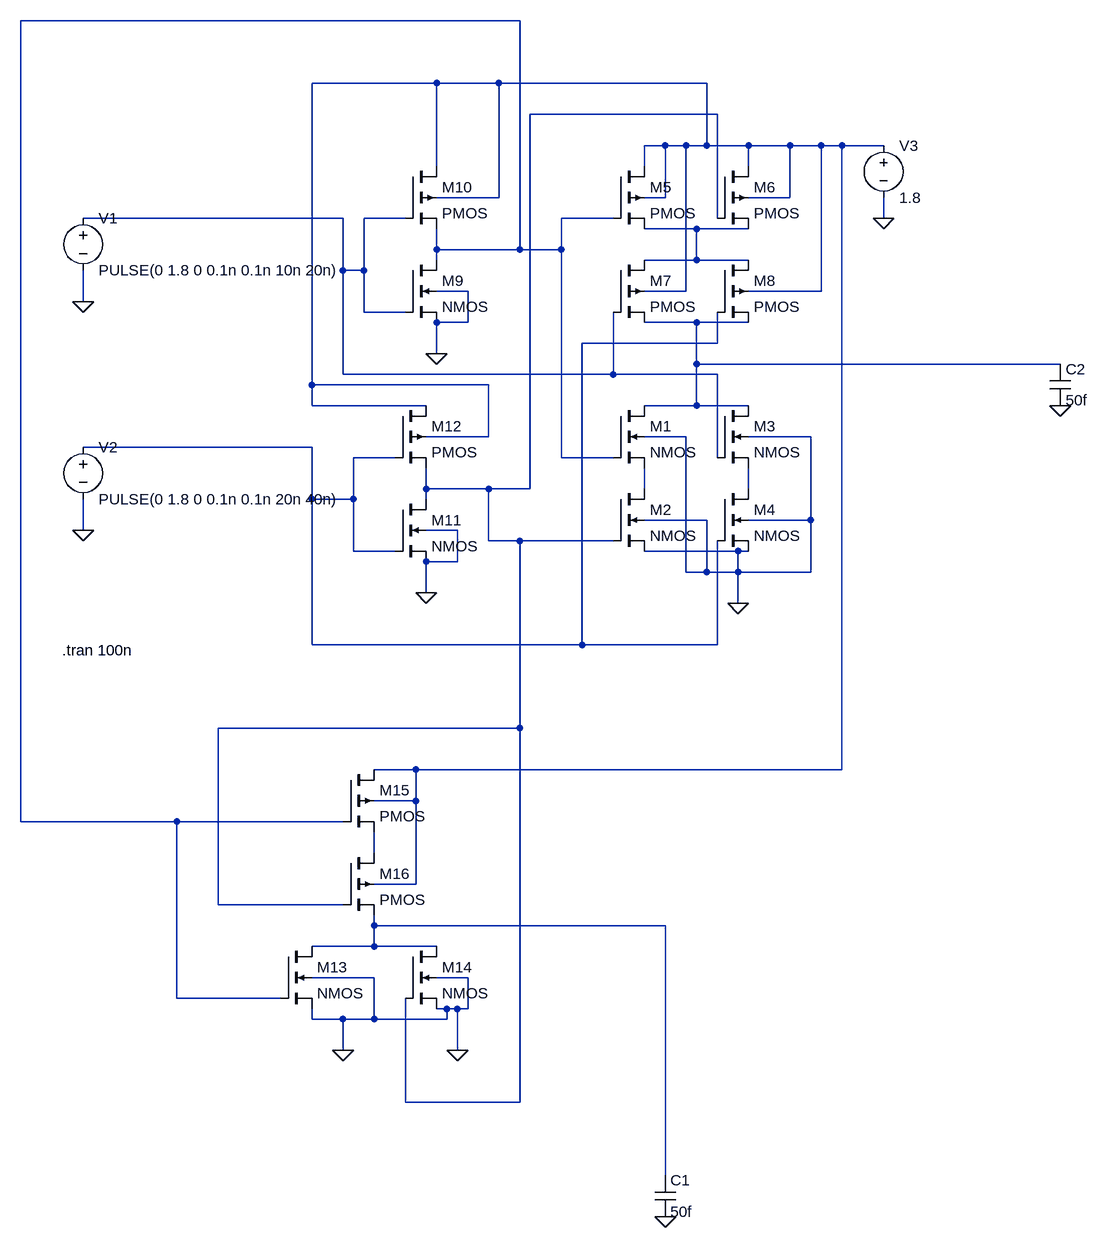
[diagram p0: schematic half adder.asc]
half adder.asc, the LTspice schematic file:
Version 4.1
SHEET 1 2688 1844
WIRE 16 -320 -752 -320
WIRE -112 -224 -304 -224
WIRE -16 -224 -112 -224
WIRE 304 -224 -16 -224
WIRE 320 -176 32 -176
WIRE 240 -128 208 -128
WIRE 272 -128 240 -128
WIRE 304 -128 304 -224
WIRE 304 -128 272 -128
WIRE 368 -128 304 -128
WIRE 432 -128 368 -128
WIRE 480 -128 432 -128
WIRE 512 -128 480 -128
WIRE 576 -128 512 -128
WIRE -112 -96 -112 -224
WIRE 208 -96 208 -128
WIRE 368 -96 368 -128
WIRE -16 -48 -16 -224
WIRE -16 -48 -112 -48
WIRE 240 -48 240 -128
WIRE 240 -48 208 -48
WIRE 432 -48 432 -128
WIRE 432 -48 368 -48
WIRE -256 -16 -656 -16
WIRE -160 -16 -224 -16
WIRE 160 -16 80 -16
WIRE 320 -16 320 -176
WIRE 576 -16 576 -48
WIRE 288 0 208 0
WIRE 368 0 288 0
WIRE -112 32 -112 0
WIRE 16 32 16 -320
WIRE 16 32 -112 32
WIRE 80 32 80 -16
WIRE 80 32 16 32
WIRE -112 48 -112 32
WIRE 288 48 288 0
WIRE 288 48 208 48
WIRE 368 48 288 48
WIRE -256 64 -256 -16
WIRE -224 64 -224 -16
WIRE -224 64 -256 64
WIRE -64 96 -112 96
WIRE 272 96 272 -128
WIRE 272 96 208 96
WIRE 480 96 480 -128
WIRE 480 96 368 96
WIRE -656 112 -656 64
WIRE -224 128 -224 64
WIRE -160 128 -224 128
WIRE -64 144 -64 96
WIRE -64 144 -112 144
WIRE 288 144 208 144
WIRE 368 144 288 144
WIRE 320 176 320 128
WIRE 320 176 112 176
WIRE -112 192 -112 144
WIRE 288 208 288 144
WIRE 848 208 288 208
WIRE -256 224 -256 64
WIRE 160 224 160 128
WIRE 160 224 -256 224
WIRE 320 224 160 224
WIRE -304 240 -304 -224
WIRE -32 240 -304 240
WIRE -304 272 -304 240
WIRE -128 272 -304 272
WIRE 288 272 288 208
WIRE 288 272 208 272
WIRE 368 272 288 272
WIRE -32 320 -32 240
WIRE -32 320 -128 320
WIRE 272 320 208 320
WIRE 464 320 368 320
WIRE -304 336 -656 336
WIRE -176 352 -240 352
WIRE 80 352 80 32
WIRE 160 352 80 352
WIRE 320 352 320 224
WIRE -128 400 -128 368
WIRE -32 400 -128 400
WIRE 32 400 32 -176
WIRE 32 400 -32 400
WIRE 208 400 208 368
WIRE 368 400 368 368
WIRE -304 416 -304 336
WIRE -240 416 -240 352
WIRE -240 416 -304 416
WIRE -128 416 -128 400
WIRE 304 448 208 448
WIRE 464 448 464 320
WIRE 464 448 368 448
WIRE -656 464 -656 416
WIRE -80 464 -128 464
WIRE -32 480 -32 400
WIRE 16 480 -32 480
WIRE 160 480 16 480
WIRE -240 496 -240 416
WIRE -176 496 -240 496
WIRE 352 496 208 496
WIRE 368 496 352 496
WIRE -80 512 -80 464
WIRE -80 512 -128 512
WIRE 272 528 272 320
WIRE 304 528 304 448
WIRE 304 528 272 528
WIRE 352 528 352 496
WIRE 352 528 304 528
WIRE 464 528 464 448
WIRE 464 528 352 528
WIRE -128 560 -128 512
WIRE 352 576 352 528
WIRE -304 640 -304 416
WIRE 112 640 112 176
WIRE 112 640 -304 640
WIRE 320 640 320 480
WIRE 320 640 112 640
WIRE 16 768 16 480
WIRE 16 768 -448 768
WIRE -144 832 -208 832
WIRE 512 832 512 -128
WIRE 512 832 -144 832
WIRE -144 880 -144 832
WIRE -144 880 -208 880
WIRE -752 912 -752 -320
WIRE -512 912 -752 912
WIRE -256 912 -512 912
WIRE -208 960 -208 928
WIRE -144 1008 -144 880
WIRE -144 1008 -208 1008
WIRE -448 1040 -448 768
WIRE -256 1040 -448 1040
WIRE -208 1072 -208 1056
WIRE 240 1072 -208 1072
WIRE -208 1104 -208 1072
WIRE -208 1104 -304 1104
WIRE -112 1104 -208 1104
WIRE -208 1152 -304 1152
WIRE -64 1152 -112 1152
WIRE -512 1184 -512 912
WIRE -352 1184 -512 1184
WIRE -96 1200 -112 1200
WIRE -80 1200 -96 1200
WIRE -64 1200 -64 1152
WIRE -64 1200 -80 1200
WIRE -304 1216 -304 1200
WIRE -256 1216 -304 1216
WIRE -208 1216 -208 1152
WIRE -208 1216 -256 1216
WIRE -96 1216 -96 1200
WIRE -96 1216 -208 1216
WIRE -256 1264 -256 1216
WIRE -80 1264 -80 1200
WIRE -160 1344 -160 1184
WIRE 16 1344 16 768
WIRE 16 1344 -160 1344
WIRE 240 1456 240 1072
FLAG -112 192 0
FLAG -128 560 0
FLAG 352 576 0
FLAG -656 112 0
FLAG -656 464 0
FLAG 576 -16 0
FLAG -256 1264 0
FLAG -80 1264 0
FLAG 848 272 0
FLAG 240 1520 0
SYMBOL nmos4 160 272 R0
SYMATTR InstName M1
SYMATTR Value2 l=180n w=270n
SYMBOL nmos4 160 400 R0
SYMATTR InstName M2
SYMATTR Value2 l=180n w=270n
SYMBOL nmos4 320 272 R0
SYMATTR InstName M3
SYMATTR Value2 l=180n w=270n
SYMBOL nmos4 320 400 R0
SYMATTR InstName M4
SYMATTR Value2 l=180n w=270n
SYMBOL pmos4 160 -96 R0
SYMATTR InstName M5
SYMATTR Value2 l=180n w=810n
SYMBOL pmos4 320 -96 R0
SYMATTR InstName M6
SYMATTR Value2 l=180n w=810n
SYMBOL pmos4 160 48 R0
SYMATTR InstName M7
SYMATTR Value2 l=180n w=810n
SYMBOL pmos4 320 48 R0
SYMATTR InstName M8
SYMATTR Value2 l=180n w=810n
SYMBOL nmos4 -160 48 R0
SYMATTR InstName M9
SYMATTR Value2 l=180n w=270n
SYMBOL pmos4 -160 -96 R0
SYMATTR InstName M10
SYMATTR Value2 l=180n w=810n
SYMBOL nmos4 -176 416 R0
SYMATTR InstName M11
SYMATTR Value2 l=180n w=270n
SYMBOL pmos4 -176 272 R0
SYMATTR InstName M12
SYMATTR Value2 l=180n w=810n
SYMBOL voltage -656 -32 R0
WINDOW 123 0 0 Left 0
WINDOW 39 0 0 Left 0
SYMATTR InstName V1
SYMATTR Value PULSE(0 1.8 0 0.1n 0.1n 10n 20n)
SYMBOL voltage -656 320 R0
WINDOW 123 0 0 Left 0
WINDOW 39 0 0 Left 0
SYMATTR InstName V2
SYMATTR Value PULSE(0 1.8 0 0.1n 0.1n 20n 40n)
SYMBOL voltage 576 -144 R0
WINDOW 123 0 0 Left 0
WINDOW 39 0 0 Left 0
SYMATTR InstName V3
SYMATTR Value 1.8
SYMBOL nmos4 -352 1104 R0
SYMATTR InstName M13
SYMATTR Value2 l=180n w=270n
SYMBOL nmos4 -160 1104 R0
SYMATTR InstName M14
SYMATTR Value2 l=180n w=270n
SYMBOL pmos4 -256 832 R0
SYMATTR InstName M15
SYMATTR Value2 l=180n w=810n
SYMBOL pmos4 -256 960 R0
SYMATTR InstName M16
SYMATTR Value2 l=180n w=810n
SYMBOL cap 224 1456 R0
SYMATTR InstName C1
SYMATTR Value 50f
SYMBOL cap 832 208 R0
SYMATTR InstName C2
SYMATTR Value 50f
TEXT -688 648 Left 2 !.tran 100n

The netlist it stands for:
* half adder.asc
M1 N006 N001 N008 0 NMOS l=180n w=270n
M2 N008 N003 0 0 NMOS l=180n w=270n
M3 N006 N004 N009 0 NMOS l=180n w=270n
M4 N009 N007 0 0 NMOS l=180n w=270n
M5 N002 N001 N005 N002 PMOS l=180n w=810n
M6 N002 N003 N005 N002 PMOS l=180n w=810n
M7 N005 N004 N006 N002 PMOS l=180n w=810n
M8 N005 N007 N006 N002 PMOS l=180n w=810n
M9 N001 N004 0 0 NMOS l=180n w=270n
M10 N002 N004 N001 N002 PMOS l=180n w=810n
M11 N003 N007 0 0 NMOS l=180n w=270n
M12 N002 N007 N003 N002 PMOS l=180n w=810n
V1 N004 0 PULSE(0 1.8 0 0.1n 0.1n 10n 20n)
V2 N007 0 PULSE(0 1.8 0 0.1n 0.1n 20n 40n)
V3 N002 0 1.8
M13 N011 N001 0 0 NMOS l=180n w=270n
M14 N011 N003 0 0 NMOS l=180n w=270n
M15 N002 N001 N010 N002 PMOS l=180n w=810n
M16 N010 N003 N011 N002 PMOS l=180n w=810n
C1 N011 0 50f
C2 N006 0 50f
.model NMOS NMOS
.model PMOS PMOS
.lib standard.mos
.tran 100n
.backanno
.end